# EasyEDA Pro project 新降压板.eprj

# Schematic Schematic1
Board Name: Board1; Create Date: 2024-11-22; Page Name: P1; Project Name: 新降压板; Schematic Name: Schematic1; Update Date: 2024-11-22; Company: 嘉立创EDA; Page Size: A4; Version: V1.0
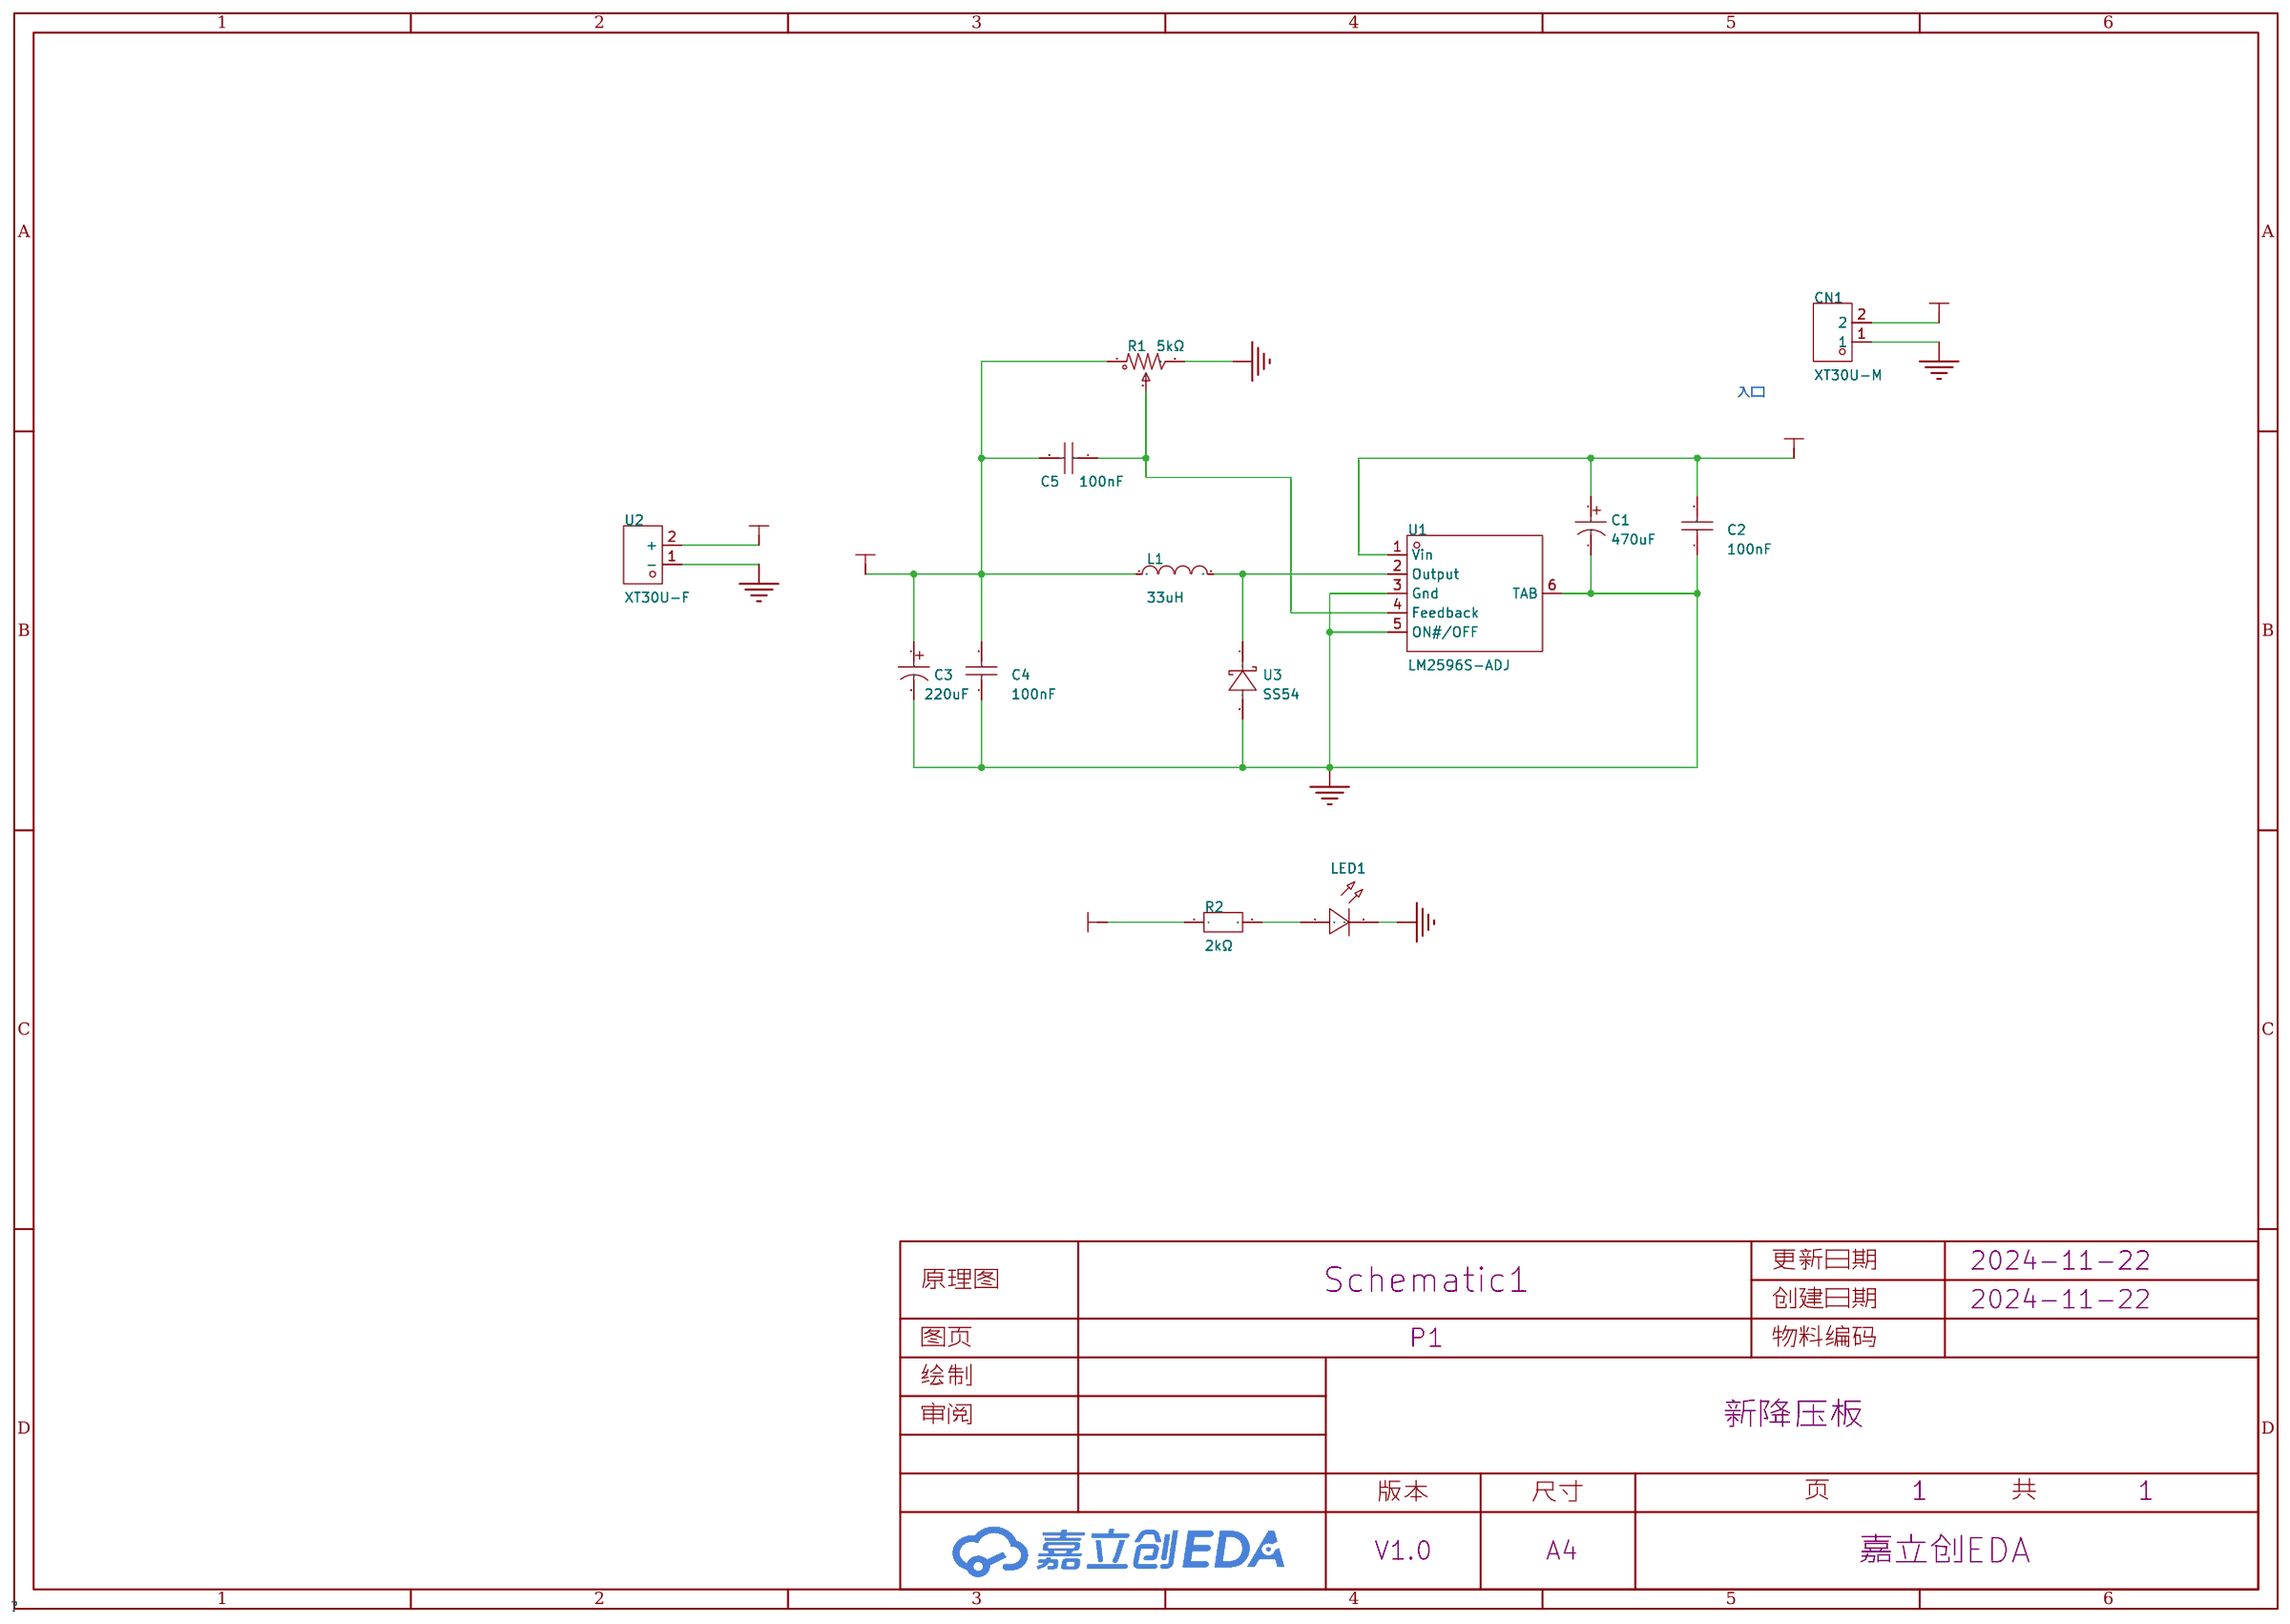
[diagram p0: schematic sheet]

## Parts
C1  470uF  [CAP-SMD_BD8.0-L8.3-W8.3-FD]
C2  100nF  [C0805]
C3  220uF  [CAP-SMD_BD6.3-L6.6-W6.6-FD]
C4  100nF  [C0805]
C5  100nF  [C0805]
CN1  XT30U-M  [CONN-TH_XT30U-M]
L1  33uH  [IND-SMD_L12.0-W12.0]
LED1  -  [LED-TH_5mm]
R1  5kΩ  [RES-ADJ-TH_3P-L9.5-W4.85-P2.50-BL-BS]
R2  2kΩ  [R0603]
U1  LM2596S-ADJ  [TO-263-5_L10.2-W8.9-P1.70-BR]
U2  XT30U-F  [CONN-TH_XT30U-F]
U3  SS54  [SMA_L4.2-W2.6-LS5.1-RD]

## Library data of the parts
C1 = RVE1C471M0810_C107396: LCSC Part Name: 470uF ±20% 16V; Supplier Part: C107396; Manufacturer: ROQANG(容强); Manufacturer Part: RVE1C471M0810; Supplier Footprint: SMD,D8xL10.2mm; Datasheet: https://atta.szlcsc.com/upload/public/pdf/source/20180326/C107396_C6FCF70791E640AE09F0B90B652FE7BA.pdf; Supplier: LCSC; Tolerance: ±20%; Rated Voltage: 16V; Ripple Current: 450mA@120Hz; Equivalent Series Resistance(ESR): 430mΩ; φD: 8mm; L: 10.2mm; Lifetime @ Temp: 2000hrs@105℃; Operating Temperature: -55℃~+105℃
C2 C4 C5 = CL21B104KBCNNNC: LCSC Part Name: 100nF ±10% 50V; Supplier Part: C1711; Manufacturer: SAMSUNG(三星); Supplier Footprint: 0805; JLCPCB Part Class: 扩展库; Datasheet: https://atta.szlcsc.com/upload/public/pdf/source/20160218/1457707763339.pdf; Supplier: LCSC; Tolerance: ±10%; Voltage Rated: 50V; Temperature Coefficient: X7R
C3 = VT1C221M0607: LCSC Part Name: 220uF ±20% 16V; Supplier Part: C90274; Manufacturer: ROQANG(容强); Supplier Footprint: SMD,D6.3xL7.7mm; Datasheet: https://atta.szlcsc.com/upload/public/pdf/source/20161207/1481104186053.pdf; Supplier: LCSC; Tolerance: ±20%; Rated Voltage: 16V; Ripple Current: 110mA@120Hz; φD: 6.3mm; L: 7.7mm; Lifetime @ Temp: 2000hrs@105℃; Operating Temperature: -40℃~+105℃
CN1 = XT30U-M: 类别:-;类型1:-;; LCSC Part Name: AMASS(艾迈斯)轻量版锂电池插头公头 XT30U-M; Supplier Part: C99101; Manufacturer: AMASS(艾迈斯); JLCPCB Part Class: Extended Part; Datasheet: https://atta.szlcsc.com/upload/public/pdf/source/20170606/1496716542582.pdf; Supplier: LCSC; Brand: 艾迈斯; Type: 插头; Colour: 黄色; InterfaceType: 公头
L1 = SLH1207S330MTT: LCSC Part Name: 33uH ±20%; Supplier Part: C181844; Manufacturer: Sunltech(韩国顺磁); Supplier Footprint: SMD; JLCPCB Part Class: 扩展库; Datasheet: https://atta.szlcsc.com/upload/public/pdf/source/20180509/C216200_948378E1D3CCC25B70CFE5927CB2C576.pdf; Supplier: LCSC; Tolerance: ±20%; Rated Current: 3A; DC Resistance (DCR): 64.8mΩ
LED1 = LED_TH-R_5mm: Supplier Footprint: 插件
R1 = 3296W-1-502: LCSC Part Name: 5kΩ ±10%; Supplier Part: C118907; Manufacturer: BOCHEN(博晨); Supplier Footprint: 插件; JLCPCB Part Class: 扩展库; Datasheet: https://atta.szlcsc.com/upload/public/pdf/source/20171114/C118907_15106326547951117397.pdf; Supplier: LCSC; Tolerance: ±10%
R2 = SC0603F2001F2BNRH: LCSC Part Name: 2kΩ ±1%; Supplier Part: C3152136; Manufacturer: Sunway(信维通信); Supplier Footprint: 0603; Datasheet: https://atta.szlcsc.com/upload/public/pdf/source/20220728/FFCE43BB6DF8FA16AEE331F0F4B289DE.pdf; Supplier: LCSC; Tolerance: ±1%; Temperature Coefficient: ±100ppm/℃
U1 = LM2596S-ADJ_C347423: LCSC Part Name: 3A降压稳压器; Supplier Part: C347423; Manufacturer: UMW(友台半导体); Supplier Footprint: TO-263-5; JLCPCB Part Class: 扩展库; Datasheet: https://atta.szlcsc.com/upload/public/pdf/source/20241113/7515F50B4FEE0270D4DE7078364C87FA.pdf; Supplier: LCSC; Function: 降压型; Output Type: 可调; Input Voltage: 40V; Output Voltage: 1.2V~37V; Output Current: 3A; Switching Frequency: 150kHz; Operating Temperature: -40℃~+125℃@(TA); Synchronous Rectification: 否; Number of Outputs: 1; Topology: 降压式; Quiescent Current (Iq): 80uA; Switch tube (built-in/external): 内置
U2 = XT30U-F: LCSC Part Name: AMASS(艾迈斯)轻量版锂电池插头母头 XT30U-F; Supplier Part: C99102; Manufacturer: AMASS(艾迈斯); JLCPCB Part Class: Extended Part; Datasheet: https://atta.szlcsc.com/upload/public/pdf/source/20190916/C428721_B0ECB8C5937139CEFE8736D2D3175B0E.pdf; Supplier: LCSC; Brand: 艾迈斯; Type: 插头; Colour: 黄色; InterfaceType: 母头
U3 = SS54: Supplier Part: C9900023219; Supplier Footprint: (1N5824)DO-214; JLCPCB Part Class: 扩展库; Supplier: LCSC

## Nets
3V3: C3.1 C4.2 C5.2 L1.1 R1.1 R2.1 U2.2(+)
12V: C1.1 C2.2 CN1.2 U1.1(Vin)
GND: C1.2 C2.1 C3.2 C4.1 CN1.1 LED1.2(A) R1.3 U1.3(Gnd) U1.5(ON#/OFF) U1.6(TAB) U2.1(-) U3.2(A)
$1N958: L1.2 U1.2(Output) U3.1(C)
$1N1467: C5.1 R1.2 U1.4(Feedback)
$1N1762: LED1.1(C) R2.2

## Notes on the sheet
- 入口

# Board PCB1
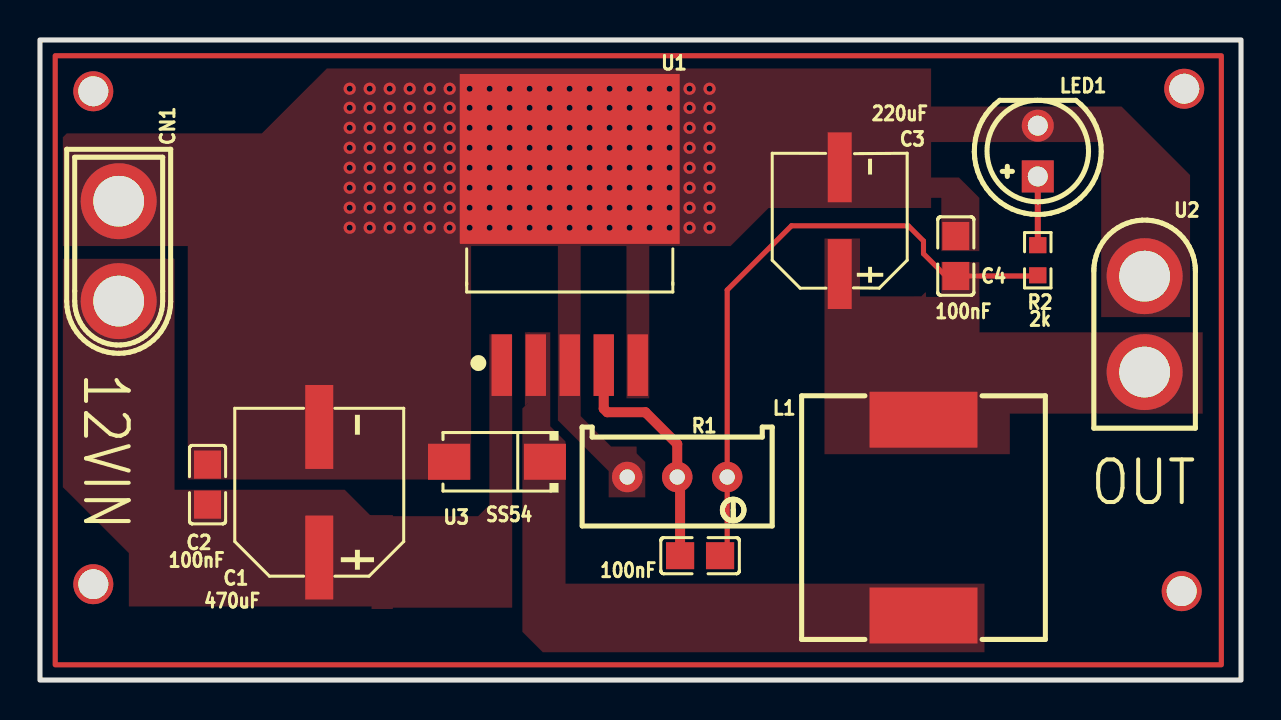
[diagram p1: board, top side]
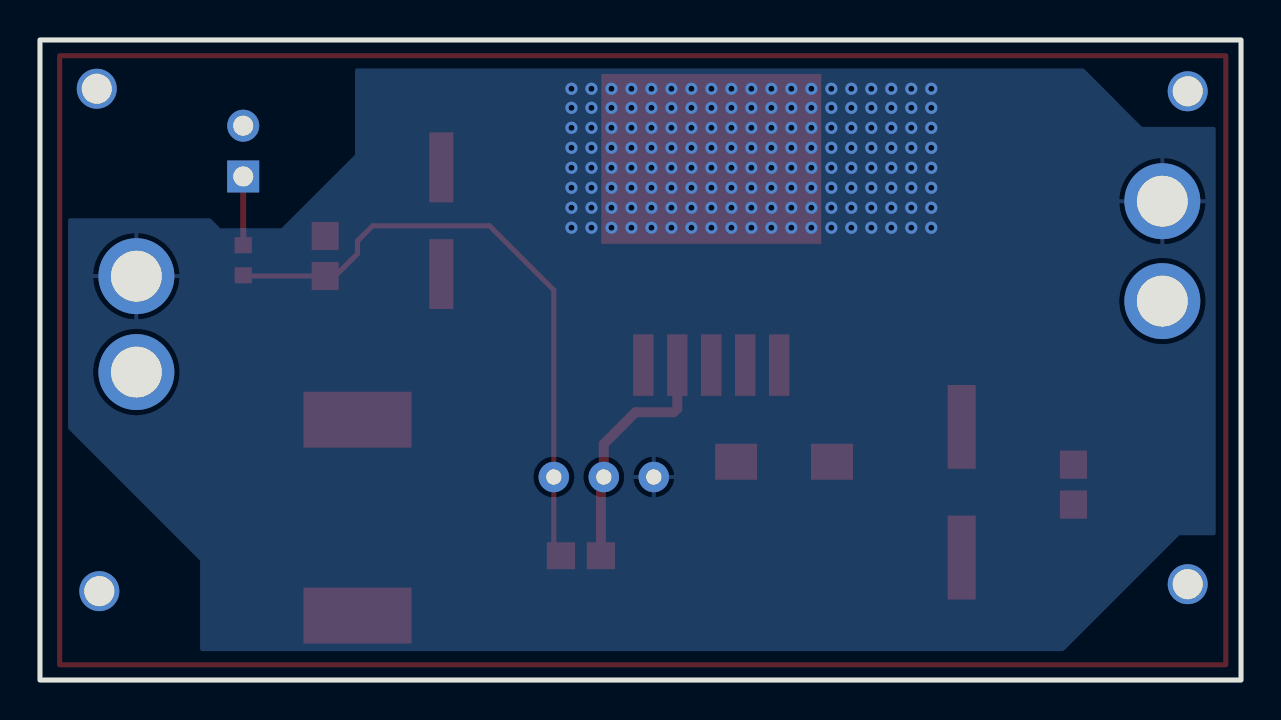
[diagram p2: board, bottom side, seen from below]

Outline 60.08 x 32.03 mm; copper layers: Top Layer, Bottom Layer. Coordinates in mm from the lower left corner of the outline.
Outline path: rectangle 0,32.03 60.08,0
Stack: Top Layer 0.035mm / Dielectric1 1.51mm FR4 er 4.5 / Bottom Layer 0.035mm

## Design rules (mm)
template: JLCPCB Capability(Two Layers Board)
spacing copperThickness1oz (default): track to track 0.102, other pairs 0.152 to 0.3
spacing copperThickness2oz: track to track 0.203, other pairs 0.152 to 0.3
track width copperThickness1oz (default): min 0.127, default 0.254, max 2.54
track width copperThickness2oz: min 0.203, default 0.254, max 2.54
differential pair differentialPair (default): width min 0.127, default 0.254, max 2.54; gap min 0.152, default 0.152
via viaSize (default): diameter min 0.5, default 0.61, max 10; hole min 0.3, default 0.305, max 6.3

## Placement (name value [footprint] x y rotation side)
C1  470uF  [CAP-SMD_BD8.0-L8.3-W8.3-FD]  13.97 9.4 90 top
C2  100nF  [C0805]  8.38 9.78 270 top
C3  220uF  [CAP-SMD_BD6.3-L6.6-W6.6-FD]  40 22.99 90 top
C4  100nF  [C0805]  45.81 21.22 270 top
C5  100nF  [C0805]  33.02 6.22 0 top
CN1  XT30U-M  [CONN-TH_XT30U-M]  3.94 21.46 270 top
L1  33uH  [IND-SMD_L12.0-W12.0]  44.2 8.13 90 top
LED1  -  [LED-TH_5mm]  49.91 26.47 90 top
NOREF  -  [Pad_e181]  57.24 29.59 0 top
NOREF#2  -  [Pad_e184]  57.11 4.45 0 top
NOREF#3  -  [Pad_e183]  2.67 4.8 0 top
NOREF#4  -  [Pad_e180]  2.67 29.46 0 top
R1  5kΩ  [RES-ADJ-TH_3P-L9.5-W4.85-P2.50-BL-BS]  31.88 10.16 270 top
R2  2kΩ  [R0603]  49.91 21.01 90 top
U1  LM2596S-ADJ  [TO-263-5_L10.2-W8.9-P1.70-BR]  26.5 20.92 270 top
U2  XT30U-F  [CONN-TH_XT30U-F]  55.26 17.81 90 top
U3  SS54  [SMA_L4.2-W2.6-LS5.1-RD]  22.86 10.92 180 top

## Footprints (pads in the part's own frame, mm; a bottom-side part is the same pattern mirrored in y, then rotated)
C0805
  rect 1.41x1.35 smd: 1(-1,0) 2(1,0)
CAP-SMD_BD6.3-L6.6-W6.6-FD
  rect 3.5x1.2 smd: 1(-2.67,0) 2(2.67,0)
CAP-SMD_BD8.0-L8.3-W8.3-FD
  rect 4.2x1.4 smd: 1(-3.267,0) 2(3.267,0)
CONN-TH_XT30U-F
  round 3.8 hole 2.54: 1(2.4,0) 2(-2.4,0)
CONN-TH_XT30U-M
  round 3.8 hole 2.54: 1(-2.5,0) 2(2.5,0)
IND-SMD_L12.0-W12.0
  rect 2.8x5.4 smd: 1(4.9,0) 2(-4.9,0)
LED-TH_5mm
  rect 1.6x1.6 hole 1: 1(-1.27,0)
  round 1.6 hole 1: 2(1.27,0)
Pad_e180
  round 2 hole 1.5: 1(0,0)
Pad_e181
  round 2 hole 1.5: 2(0,0)
Pad_e183
  round 2 hole 1.5: 1(0,0)
Pad_e184
  round 2 hole 1.5: 2(0,0)
R0603
  rect 0.806x0.864 smd: 1(-0.753,0) 2(0.753,0)
RES-ADJ-TH_3P-L9.5-W4.85-P2.50-BL-BS
  round 1.524 hole 0.762: 1(0,2.5) 2(0,0) 3(0,-2.5)
SMA_L4.2-W2.6-LS5.1-RD
  rect 2.1x1.8 smd: 1(-2.4,0) 2(2.4,0)
TO-263-5_L10.2-W8.9-P1.70-BR
  rect 3.083x1.02 smd: 1(5.16,-3.4) 2(5.16,-1.7) 3(5.16,0) 4(5.16,1.7) 5(5.16,3.4)
  rect 8.5x11 smd: 6(-5.16,0)

## Nets
As in the schematic.

Pads without a net: NOREF 2; NOREF#2 2; NOREF#3 1; NOREF#4 1

## Via types
v1: diameter 0.61, hole 0.305, Top Layer to Bottom Layer, 152 vias

## Routing (per net, layer and track width the routed paths; a pad name or vN(x,y) marks a point on that pad's centre or on a via; arc(x,y) is an arc through that point)
3V3: length 31.7
  Top Layer w0.254: R2.1 49.88,20.22 C4.2 45.31,20.22 44.2,21.34 44.2,21.97 43.43,22.73 37.59,22.73 34.38,19.52 R1.1 34.38,6.58 C5.2
GND:
  vias: v1(15.49,29.59) v1(15.49,28.64) v1(15.49,27.64) v1(15.49,26.64) v1(15.49,25.64) v1(15.49,24.64) v1(15.49,23.64) v1(15.49,22.64) v1(16.49,29.59) v1(16.49,28.64) v1(16.49,27.64) v1(16.49,26.64) v1(16.49,25.64) v1(16.49,24.64) v1(16.49,23.64) v1(16.49,22.64) v1(17.49,29.59) v1(17.49,28.64) v1(17.49,27.64) v1(17.49,26.64) v1(17.49,25.64) v1(17.49,24.64) v1(17.49,23.64) v1(17.49,22.64) v1(18.49,29.59) v1(18.49,28.64) v1(18.49,27.64) v1(18.49,26.64) v1(18.49,25.64) v1(18.49,24.64) v1(18.49,23.64) v1(18.49,22.64) v1(19.49,29.59) v1(19.49,28.64) v1(19.49,27.64) v1(19.49,26.64) v1(19.49,25.64) v1(19.49,24.64) v1(19.49,23.64) v1(19.49,22.64) v1(20.49,29.59) v1(20.49,28.64) v1(20.49,27.64) v1(20.49,26.64) v1(20.49,25.64) v1(20.49,24.64) v1(20.49,23.64) v1(20.49,22.64) v1(21.49,29.59) v1(21.49,28.64) v1(21.49,27.64) v1(21.49,26.64) v1(21.49,25.64) v1(21.49,24.64) v1(21.49,23.64) v1(21.49,22.64) v1(22.49,29.59) v1(22.49,28.64) v1(22.49,27.64) v1(22.49,26.64) v1(22.49,25.64) v1(22.49,24.64) v1(22.49,23.64) v1(22.49,22.64) v1(23.49,29.59) v1(23.49,28.64) v1(23.49,27.64) v1(23.49,26.64) v1(23.49,25.64) v1(23.49,24.64) v1(23.49,23.64) v1(23.49,22.64) v1(24.49,29.59) v1(24.49,28.64) v1(24.49,27.64) v1(24.49,26.64) v1(24.49,25.64) v1(24.49,24.64) v1(24.49,23.64) v1(24.49,22.64) v1(25.49,29.59) v1(25.49,28.64) v1(25.49,27.64) v1(25.49,26.64) v1(25.49,25.64) v1(25.49,24.64) v1(25.49,23.64) v1(25.49,22.64) v1(26.49,29.59) v1(26.49,28.64) v1(26.49,27.64) v1(26.49,26.64) v1(26.49,25.64) v1(26.49,24.64) v1(26.49,23.64) v1(26.49,22.64) v1(27.49,29.59) v1(27.49,28.64) v1(27.49,27.64) v1(27.49,26.64) v1(27.49,25.64) v1(27.49,24.64) v1(27.49,23.64) v1(27.49,22.64) v1(28.49,29.59) v1(28.49,28.64) v1(28.49,27.64) v1(28.49,26.64) v1(28.49,25.64) v1(28.49,24.64) v1(28.49,23.64) v1(28.49,22.64) v1(29.49,29.59) v1(29.49,28.64) v1(29.49,27.64) v1(29.49,26.64) v1(29.49,25.64) v1(29.49,24.64) v1(29.49,23.64) v1(29.49,22.64) v1(30.49,29.59) v1(30.49,28.64) v1(30.49,27.64) v1(30.49,26.64) v1(30.49,25.64) v1(30.49,24.64) v1(30.49,23.64) v1(30.49,22.64) v1(31.49,29.59) v1(31.49,28.64) v1(31.49,27.64) v1(31.49,26.64) v1(31.49,25.64) v1(31.49,24.64) v1(31.49,23.64) v1(31.49,22.64) v1(32.49,29.59) v1(32.49,28.64) v1(32.49,27.64) v1(32.49,26.64) v1(32.49,25.64) v1(32.49,24.64) v1(32.49,23.64) v1(32.49,22.64) v1(33.49,29.59) v1(33.49,28.64) v1(33.49,27.64) v1(33.49,26.64) v1(33.49,25.64) v1(33.49,24.64) v1(33.49,23.64) v1(33.49,22.64)
$1N1467: length 12.2
  Top Layer w0.5: U1.4 28.2,13.58 28.38,13.4 30.29,13.4 31.88,11.81 R1.2 32.02,10.02 C5.1
$1N1762: length 3.4
  Top Layer w0.3: LED1.1 R2.2

## Copper pours and planes (outline as drawn; the poured copper is in the pictures)
3V3 on Top Layer: 43.69,19.18 46.99,19.18 46.99,17.34 43.69,17.34
3V3 on Top Layer: 45.09,20.95 46.99,20.95 46.99,15.37 45.09,15.37
3V3 on Top Layer: 39.24,22.1 58.17,22.1 58.17,11.3 39.24,11.3
12V on Top Layer: 16.64,17.3 23.62,17.3 23.62,3.62 16.64,3.62
12V on Top Layer: 16,8.25 17.65,8.25 17.65,3.56 16,3.56
12V on Top Layer: 1.14,21.08 16.64,21.08 16.64,3.68 1.14,3.68
GND on Top Layer: 25.91,25.41 30.28,25.41 30.28,9.14 25.91,9.14
GND on Top Layer: 1.14,30.61 44.58,30.61 44.58,21.72 1.14,21.72
GND on Top Layer: 42.88,25.15 46.99,25.15 46.99,21.46 42.88,21.46
GND on Top Layer: 40.56,28.7 57.53,28.7 57.53,18.16 40.56,18.16
GND on Top Layer: 7.39,22.33 21.57,22.33 21.57,10.03 7.39,10.03
GND on Top Layer: 29.21,26.16 30.48,26.16 30.48,14.1 29.21,14.1
GND on Bottom Layer: 1.27,27.69 1.27,7.24 3.09,7.24 8.89,1.44 52.07,1.44 52.07,5.97 58.67,12.57 58.67,23.11 51.56,23.11 51.05,22.61 48.01,22.61 44.32,26.29 44.32,30.61 7.87,30.61 4.95,27.69
$1N958 on Top Layer: 24.13,17.4 47.24,17.4 47.24,1.39 24.13,1.39

Small or netless copper shapes (teardrops, artwork), in the pictures only: 2 on Top Layer

## Text on the board
Top Silkscreen Layer: 100nF | 470uF | SS54 | 220uF | 2k | OUT | 12VIN
